# Altium schematic sheet Sensor Board.SchDoc
size A3; SheetNumber: 5
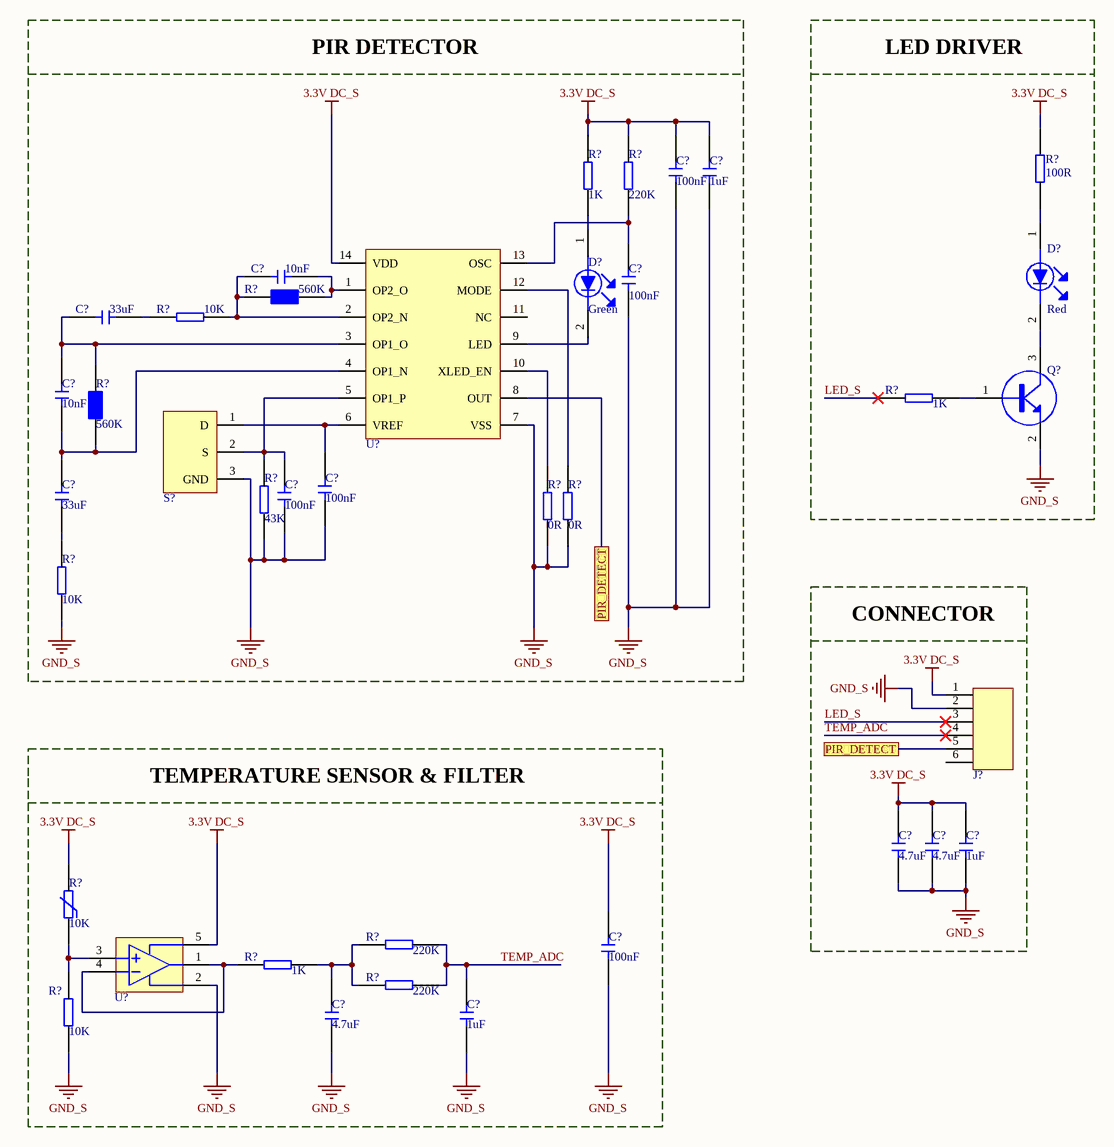
[diagram p0: Sensor Board.SchDoc]

## Parts
(Parts that share a designator on the sheet are numbered #1, #2 ... from top to bottom, then left to right.)
C?#1  Capacitance: 100nF  [CAP_0603]  (hidden comment: C0603C104K5RACTU)
C?#2  Capacitance: 1uF  [CAP_0805]  (hidden comment: CL21B105KBFNNNE)
C?#3  Capacitance: 10nF  [CAP_0603]  (hidden comment: 0603B103K160CT)
C?#4  Capacitance: 33uF  [CAP_1206]  (hidden comment: C3216X5R1E336M160AC)
C?#5  Capacitance: 100nF  [CAP_0603]  (hidden comment: C0603C104K5RACTU)
C?#6  Capacitance: 10nF  [CAP_0603]  (hidden comment: 0603B103K160CT)
C?#7  Capacitance: 100nF  [CAP_0603]  (hidden comment: C0603C104K5RACTU)
C?#8  Capacitance: 100nF  [CAP_0603]  (hidden comment: C0603C104K5RACTU)
C?#9  Capacitance: 33uF  [CAP_1206]  (hidden comment: C3216X5R1E336M160AC)
C?#10  Capacitance: 4.7uF  [CAP_0805]  (hidden comment: CL21A475KAQNNNE)
C?#11  Capacitance: 4.7uF  [CAP_0805]  (hidden comment: CL21A475KAQNNNE)
C?#12  Capacitance: 1uF  [CAP_0805]  (hidden comment: CL21B105KBFNNNE)
C?#13  Capacitance: 100nF  [CAP_0603]  (hidden comment: C0603C104K5RACTU)
C?#14  Capacitance: 4.7uF  [CAP_0805]  (hidden comment: CL21A475KAQNNNE)
C?#15  Capacitance: 1uF  [CAP_0805]  (hidden comment: CL21B105KBFNNNE)
D?#1  Color: Red  [LED RED_0805]  (hidden comment: LH R974-LP-1)
D?#2  Color: Green  [LED GREEN_0805]  (hidden comment: LTST-C171GKT)
J?  64800611622  [64800611622_6 PIN CON]  (value not drawn)
Q?  MMBT3904-7-F  [SOT-23F]  (value not drawn)
R?#1  Resistance: 100R  [RES_0603]  (hidden comment: RC0603JR-07100RL)
R?#2  Resistance: 1K  [RES_0603]  (hidden comment: RC0603FR-071KL)
R?#3  Resistance: 220K  [RES_0603]  (hidden comment: RC0603JR-07220KL)
R?#4  Resistance: 560K  [RES_0603]  (hidden comment: RC0603JR-07560KL)
R?#5  Resistance: 10K  [RES_0603]  (hidden comment: RC0603FR-0710KL)
R?#6  Resistance: 1K  [RES_0603]  (hidden comment: RC0603FR-071KL)
R?#7  Resistance: 560K  [RES_0603]  (hidden comment: RC0603JR-07560KL)
R?#8  Resistance: 43K  [RES_0603]  (hidden comment: RC0603JR-0743KL)
R?#9  Resistance: 0R  [RES_0603]  (hidden comment: RC0603JR-070RL)
R?#10  Resistance: 0R  [RES_0603]  (hidden comment: RC0603JR-070RL)
R?#11  Resistance: 10K  [RES_0603]  (hidden comment: RC0603FR-0710KL)
R?#12  Resistance: 10K  [RES_1206]  (hidden comment: TFPT1206L1002FM)
R?#13  Resistance: 220K  [RES_0603]  (hidden comment: RC0603JR-07220KL)
R?#14  Resistance: 1K  [RES_0603]  (hidden comment: RC0603FR-071KL)
R?#15  Resistance: 220K  [RES_0603]  (hidden comment: RC0603JR-07220KL)
R?#16  Resistance: 10K  [RES_0603]  (hidden comment: RC0603FR-0710KL)
S?  LHI 878/3902  [LHI 878]  (value not drawn)
U?#1  NCS36000DRG  [SOIC-14]  (value not drawn)
U?#2  OPA314AIDBVR  [SOT23-5]  (value not drawn)

## Blocks framed on the sheet
PIR DETECTOR: C?#1-C?#9 D?#2 R?#2-R?#5 R?#7-R?#11 S? U?#1

## Ports
PIR_DETECT

## Nets
3.3V DC_S: C?#1.2 C?#2.2 C?#10.2 C?#11.2 C?#12.2 C?#13.1 J?.1 R?#1.1 R?#2.2 R?#3.2 R?#12.2 U?#1.14(VDD) U?#2.5
GND_S: C?#1.1 C?#2.1 C?#5.1 C?#7.2 C?#8.1 C?#10.1 C?#11.1 C?#12.1 C?#13.2 C?#14.1 C?#15.1 J?.2 Q?.2(E) R?#8.1 R?#9.1 R?#10.1 R?#11.1 R?#16.1 S?.3(GND) U?#1.7(VSS) U?#2.2
LED_S: J?.3 R?#6.1
PIR_DETECT: J?.5 U?#1.8(OUT) ; port PIR_DETECT
TEMP_ADC: C?#15.2 J?.4 R?#13.2 R?#15.2
NetC?#3_1: C?#3.1 R?#4.1 R?#5.2 U?#1.2(OP2_N)
NetC?#3_2: C?#3.2 R?#4.2 U?#1.1(OP2_O)
NetC?#4_1: C?#4.1 C?#6.2 R?#7.2 U?#1.3(OP1_O)
NetC?#4_2: C?#4.2 R?#5.1
NetC?#5_2: C?#5.2 R?#3.1 U?#1.13(OSC)
NetC?#6_1: C?#6.1 C?#9.2 R?#7.1 U?#1.4(OP1_N)
NetC?#7_1: C?#7.1 R?#8.2 S?.2(S) U?#1.5(OP1_P)
NetC?#8_2: C?#8.2 S?.1(D) U?#1.6(VREF)
NetC?#9_1: C?#9.1 R?#11.2
NetC?#14_2: C?#14.2 R?#13.1 R?#14.2 R?#15.1
NetD?#1_1: D?#1.1(A) R?#1.2
NetD?#1_2: D?#1.2(K) Q?.3(C)
NetD?#2_1: D?#2.1(A) R?#2.1
NetD?#2_2: D?#2.2(K) U?#1.9(LED)
NetQ?_1: Q?.1(B) R?#6.2
NetR?#9_2: R?#9.2 U?#1.10(XLED_EN)
NetR?#10_2: R?#10.2 U?#1.12(MODE)
NetR?#12_1: R?#12.1 R?#16.2 U?#2.3
NetR?#14_1: R?#14.1 U?#2.1 U?#2.4

Not connected (* = marked no-connect by the designer): J? 6; U?#1 11(NC)

## Notes on the sheet
- LED DRIVER
- CONNECTOR
- TEMPERATURE SENSOR & FILTER
- Tanım/Description
- Hazırlayan/Prepared By
- Kontrol Eden/Checked By
- Değiştirme Tarihi/Change Date
- Yayın Tarihi/Release Date
- Mehmet Ali
- Onaylayan/Approved By
- Revizyon/Revision
- Hayta
- Bölüm/Department
- Dosya Adı/File Name
- Electronics&Hardware
- Boyut/Size
- Sayfa/Sheet
- A-3
- /

## Library data of the parts
C?#1 C?#5 C?#7 C?#8 C?#13 = CAP CER 100NF 0603: CAP CER 100NF %10 0603 SMD; Manufacturer: KEMET; Designed By: HAYTA; Dielectric Material: Ceramic; Voltage Rating (DC): 50V; Tolerance: 10%; Dielectric: X7R; Dissipation Factor: 2.5%; Supplier 1: Digi-Key; Manufacturer Part Number: C0603C104K5RACTU; RoHS: Yes; Category: Ceramic Capacitors; Mount: Surface Mount; Case/Package: CAP_0603; Number of Pins: 2; Case Code (Metric): 1608; Case Code (Imperial): 0603; Contact Plating: Tin,Matte; Min Operating Temperature: -55°C; Max Operating Temperature: 125°C; Packaging: Tape and Reel; Package Quantity: 1; Termination: SMD/SMT; Voltage: 50V; Voltage Rating: 50V; Series: SMD Comm X7R; Length: 0.063inch; Width: 0.031inch; Height: 0.8mm; Thickness: 0.034inch; Lead Pitch: 0.7mm; Depth: 0.8mm; Radiation Hardening: No; RoHS Compliant: Yes; REACH SVHC: No SVHC; ComponentLink1URL: https://datasheet.ciiva.com/7823/kem-c1002-x7r-smd-7823591.pdf?src-supplier=Element14; ComponentLink1Description: https://datasheet.ciiva.com/7823/kem-c1002-x7r-smd-7823591.pdf?src-supplier=Element14; ComponentLink2URL: https://datasheet.ciiva.com/7823/kem-c1002-x7r-smd-7823592.pdf?src-supplier=Element14; ComponentLink2Description: https://datasheet.ciiva.com/7823/kem-c1002-x7r-smd-7823592.pdf?src-supplier=Element14; ComponentLink3URL: https://datasheet.ciiva.com/5999/kem-c1002-x7r-smd-5999400.pdf?src-supplier=Farnell; ComponentLink3Description: https://datasheet.ciiva.com/5999/kem-c1002-x7r-smd-5999400.pdf?src-supplier=Farnell; ComponentLink4URL: https://datasheet.ciiva.com/28645/1851736-28645640.pdf?src-supplier=Element14; ComponentLink4Description: https://datasheet.ciiva.com/28645/1851736-28645640.pdf?src-supplier=Element14; ComponentLink5URL: https://datasheet.ciiva.com/14585/70095383-14585209.pdf?src-supplier=Allied+Electronics; ComponentLink5Description: https://datasheet.ciiva.com/14585/70095383-14585209.pdf?src-supplier=Allied+Electronics; ComponentLink6URL: https://datasheet.ciiva.com/14602/70095383-14602583.pdf?src-supplier=Allied+Electronics; ComponentLink6Description: https://datasheet.ciiva.com/14602/70095383-14602583.pdf?src-supplier=Allied+Electronics; Supplier Part Number 1: 399-5089-1-ND
C?#2 C?#12 C?#15 = CAP CER 1UF 0805: CAP CER 1UF %10 0805; Manufacturer: Samsung; Tolerance: 10%; Voltage Rating: 50V; Dielectric: X7R; Designed By: HAYTA; Supplier 1: Digi-Key; Manufacturer Part Number: CL21B105KBFNNNE; RoHS: Yes; Category: Ceramic Capacitors; Stock 1: 68093; Pricing 1: 1=0.12000, 10=0.08600, 50=0.04900, 100=0.04060, 500=0.02848, 1000=0.02358 (USD); Mount: Surface Mount; Case/Package: CAP_0805; Case Code (Metric): 2012; Case Code (Imperial): 0805; Min Operating Temperature: -55°C; Max Operating Temperature: 125°C; Packaging: Tape and Reel; Package Quantity: 1; Voltage: 50V; Series: CL; Construction: Flat; Length: 2mm; Width: 0.049inch; Height: 1.25mm; Thickness: 0.053inch; Depth: 1.25mm; Radiation Hardening: No; RoHS Compliant: Yes; ComponentLink1URL: https://datasheet.ciiva.com/25800/cl21b105kbfnnne-25800291.pdf?src-supplier=Digi-Key; ComponentLink1Description: https://datasheet.ciiva.com/25800/cl21b105kbfnnne-25800291.pdf?src-supplier=Digi-Key; ComponentLink2URL: https://datasheet.ciiva.com/16449/cl21b105kbfnnne-16449003.pdf?src-supplier=Future+Electronics; ComponentLink2Description: https://datasheet.ciiva.com/16449/cl21b105kbfnnne-16449003.pdf?src-supplier=Future+Electronics; ComponentLink3URL: https://datasheet.ciiva.com/26838/getdatasheetpartid-354075-26838668.pdf?src-supplier=Verical; ComponentLink3Description: https://datasheet.ciiva.com/26838/getdatasheetpartid-354075-26838668.pdf?src-supplier=Verical; Supplier Part Number 1: 1276-1029-1-ND
C?#3 C?#6 = CAP CER 10NF 0603: CAP CER 10NF %10 0603; Manufacturer: Walsin Technologies; Tolerance: 10%; Dielectric: X7R; Voltage Rating: 16V; Designed By: HAYTA; Supplier 1: Digi-Key; Manufacturer Part Number: 0603B103K160CT; RoHS: Yes; Category: Ceramic Capacitors; Stock 1: 156130; Pricing 1: 1=0.10000, 10=0.03600, 50=0.01980, 100=0.01620, 500=0.01156, 1000=0.00908 (USD); Case/Package: CAP_0603; Case Code (Metric): 1608; Case Code (Imperial): 0603; Min Operating Temperature: -55°C; Max Operating Temperature: 125°C; Packaging: Tape and Reel; Voltage Rating (DC): 16V; Length: 1.6mm; Depth: 0.8mm; REACH SVHC: Unknown; RoHS Compliant: Yes; ComponentLink1URL: http://www.farnell.com/datasheets/1958513.pdf?src-supplier=Farnell; ComponentLink1Description: http://www.farnell.com/datasheets/1958513.pdf?src-supplier=Farnell; ComponentLink2URL: http://components.arrow.com/part/dataview/0323_00656382?src-supplier=Arrow+Europe; ComponentLink2Description: http://components.arrow.com/part/dataview/0323_00656382?src-supplier=Arrow+Europe; ComponentLink3URL: http://www.farnell.com/datasheets/1958513.pdf?src-supplier=Element14; ComponentLink3Description: http://www.farnell.com/datasheets/1958513.pdf?src-supplier=Element14; ComponentLink4URL: http://www.passivecomponent.com/wp-content/uploads/2018/10/MLCC.pdf?src-supplier=Digi-Key; ComponentLink4Description: http://www.passivecomponent.com/wp-content/uploads/2018/10/MLCC.pdf?src-supplier=Digi-Key; Supplier Part Number 1: 1292-1384-1-ND
C?#4 C?#9 = CAP CER 33UF 1206: CAP CER 33UF %20 1206 SMD; Manufacturer: TDK; Dielectric Material: Ceramic; Voltage Rating: 25V; Tolerance: 20%; Dielectric: X5R; Designed By: HAYTA; Supplier 1: Digi-Key; Manufacturer Part Number: C3216X5R1E336M160AC; RoHS: Yes; Category: Ceramic Capacitors; Stock 1: 308; Pricing 1: 1=1.04000, 10=0.82500, 50=0.71500, 100=0.61880, 500=0.46750, 1000=0.41250 (USD); Mount: Surface Mount; Case/Package: CAP_1206; Case Code (Metric): 3216; Case Code (Imperial): 1206; Weight: 0.000571oz; Min Operating Temperature: -55°C; Max Operating Temperature: 85°C; Packaging: Tape and Reel; Termination: SMD/SMT; Series: C; Package Quantity: 1; Voltage Rating (DC): 25V; Resistor Type: Ceramic; Length: 3.2mm; Width: 0.063inch; Depth: 1.6mm; Thickness: 1.6mm; REACH SVHC: No SVHC; Lead Free: Lead Free; RoHS Compliant: Yes; ComponentLink1URL: https://datasheet.ciiva.com/24216/c3216x5r1e336m160ac-265051-24216512.pdf?src-supplier=Mouser; ComponentLink1Description: https://datasheet.ciiva.com/24216/c3216x5r1e336m160ac-265051-24216512.pdf?src-supplier=Mouser; ComponentLink2URL: https://datasheet.ciiva.com/6285/tdkmlcccaprange-6285278.pdf?src-supplier=Digi-Key; ComponentLink2Description: https://datasheet.ciiva.com/6285/tdkmlcccaprange-6285278.pdf?src-supplier=Digi-Key; Supplier Part Number 1: 445-8046-1-ND
C?#10 C?#11 C?#14 = CAP CER 4.7UF 0805: CAP CER 4.7UF %10 0805; Manufacturer: Samsung; Tolerance: 10%; Voltage Rating: 25V; Dielectric: X5R; Designed By: HAYTA; Supplier 1: Digi-Key; Manufacturer Part Number: CL21A475KAQNNNE; RoHS: Yes; Category: Ceramic Capacitors; Stock 1: 2239290; Pricing 1: 1=0.11000, 10=0.08000, 50=0.04520, 100=0.03740, 500=0.02624, 1000=0.02172 (USD); Mount: Surface Mount; Case/Package: CAP_0805; Case Code (Metric): 2012; Case Code (Imperial): 0805; Min Operating Temperature: -55°C; Max Operating Temperature: 85°C; Package Quantity: 1; Packaging: Tape and Reel; Voltage Rating (DC): 25V; Series: CL; Construction: Flat; Length: 2mm; Width: 0.049inch; Height: 1.25mm; Thickness: 0.055inch; Depth: 1.25mm; Radiation Hardening: No; Lead Free: Lead Free; RoHS Compliant: Yes; ComponentLink1URL: https://datasheet.ciiva.com/25798/cl21a475kaqnnne-25798882.pdf?src-supplier=Digi-Key; ComponentLink1Description: https://datasheet.ciiva.com/25798/cl21a475kaqnnne-25798882.pdf?src-supplier=Digi-Key; Supplier Part Number 1: 1276-1244-1-ND
D?#1 = LED_RED 0805: LED Uni-Color Hyper Red 660nm 2-Pin Chip 0805(2012Metric) T/R; Manufacturer: Osram Opto; Lens Color: White; Forward Voltage: 1.8V; Lens Style: Diffused,Flat,Colorless; Luminous Intensity: 71mcd; Viewing Angle: 160°; Forward Current: 30mA; Dominant Wavelength: 645nm; Number of Elements: 1; Test Current: 20mA; Reverse Voltage: 5V; Lens Transparency: Diffused; Luminous Flux: 0.17lm; Lens Size: 1.25mm; Designed By: HAYTA; Supplier 1: Digi-Key; Manufacturer Part Number: LH R974-LP-1; RoHS: Yes; Category: LEDs; Mount: Surface Mount; Case/Package: LED RED_0805; Number of Pins: 2; Case Code (Imperial): 0805; Case Code (Metric): 2012; Min Operating Temperature: -30°C; Max Operating Temperature: 85°C; Packaging: Tape and Reel; Illumination Color: Red; Package Quantity: 1; Series: CHipLED; Length: 2.1mm; Width: 1.25mm; Depth: 1.35mm; Radiation Hardening: No; RoHS Compliant: Yes; ComponentLink1URL: http://www.jameco.com/Jameco/Products/ProdDS/2085634.pdf?src-supplier=Jameco; ComponentLink1Description: http://www.jameco.com/Jameco/Products/ProdDS/2085634.pdf?src-supplier=Jameco; ComponentLink2URL: http://components.arrow.com/part/dataview/0323_01825492?src-supplier=Arrow+Europe; ComponentLink2Description: http://components.arrow.com/part/dataview/0323_01825492?src-supplier=Arrow+Europe; ComponentLink3URL: https://dammedia.osram.info/media/resource/hires/osram-dam-2493888/LH%20R974.pdf?src-supplier=Digi-Key; ComponentLink3Description: https://dammedia.osram.info/media/resource/hires/osram-dam-2493888/LH%20R974.pdf?src-supplier=Digi-Key; ComponentLink4URL: http://www.mouser.com/ds/2/311/LH%20R974%20-%20CHIPLED%200805-318659.pdf?src-supplier=Mouser; ComponentLink4Description: http://www.mouser.com/ds/2/311/LH%20R974%20-%20CHIPLED%200805-318659.pdf?src-supplier=Mouser; ComponentLink5URL: http://components.arrow.com/part/dataview/41971690S1077610N9133?src-supplier=Arrow+Electronics; ComponentLink5Description: http://components.arrow.com/part/dataview/41971690S1077610N9133?src-supplier=Arrow+Electronics; ComponentLink6URL: https://www.verical.com/server-webapp/html/getDatasheet?partID=258950&src-supplier=Verical; ComponentLink6Description: https://www.verical.com/server-webapp/html/getDatasheet?partID=258950&src-supplier=Verical; ComponentLink7URL: http://components.arrow.com/part/dataview/41971690S6190115N2128?src-supplier=Arrow+Electronics; ComponentLink7Description: http://components.arrow.com/part/dataview/41971690S6190115N2128?src-supplier=Arrow+Electronics; Supplier Part Number 1: 475-1415-1-ND
D?#2 = LED_GREEN 0805: Green 0805 130 º Min 5 mcd Typical 12 mcd Water Clear Lens SMT LED; Manufacturer: Vishay Lite-On; Lens Color: Colorless; Viewing Angle: 130°; Lens Style: Diffused,Colorless,Rectangular,Clear; Luminous Intensity: 12mcd; Forward Current: 30mA; Forward Voltage: 2.1V; Power Rating: 100mW; Dominant Wavelength: 569nm; Test Current: 10mA; Number of Elements: 1; Wavelength: 585nm; Reverse Voltage: 5V; Designed By: HAYTA; Supplier 1: Digi-Key; Manufacturer Part Number: LTST-C171GKT; RoHS: Yes; Category: LEDs; Stock 1: 481058; Pricing 1: 1=0.26000, 10=0.14100, 100=0.06560, 500=0.06060, 1000=0.04747 (USD); Mount: Surface Mount; Case/Package: LED GREEN_0805; Number of Pins: 2; Case Code (Metric): 2012; Case Code (Imperial): 0805; Min Operating Temperature: -55°C; Max Operating Temperature: 85°C; Package Quantity: 1; Packaging: Tape and Reel; Illumination Color: Green; Lens Transparency: Clear; Power Dissipation: 100mW; Number of LEDs: 1; Series: CHIPLED 0805; Length: 2mm; Width: 1.25mm; Height: 0.8mm; Depth: 1.25mm; Radiation Hardening: No; Lead Free: Lead Free; RoHS Compliant: Yes; ComponentLink1URL: https://datasheet.ciiva.com/2110/ltst-c171gkt-2110000.pdf?src-supplier=Digi-Key; ComponentLink1Description: https://datasheet.ciiva.com/2110/ltst-c171gkt-2110000.pdf?src-supplier=Digi-Key; ComponentLink2URL: https://datasheet.ciiva.com/11773/0900766b80dc0296-11773991.pdf?src-supplier=RSComponents; ComponentLink2Description: https://datasheet.ciiva.com/11773/0900766b80dc0296-11773991.pdf?src-supplier=RSComponents; ComponentLink3URL: https://datasheet.ciiva.com/12400/lite-on-ltst-c171gkt-190133-12400647.pdf?src-supplier=Mouser; ComponentLink3Description: https://datasheet.ciiva.com/12400/lite-on-ltst-c171gkt-190133-12400647.pdf?src-supplier=Mouser; ComponentLink4URL: https://datasheet.ciiva.com/2110/ltst-c171gkt-2110001.pdf?src-supplier=Digi-Key; ComponentLink4Description: https://datasheet.ciiva.com/2110/ltst-c171gkt-2110001.pdf?src-supplier=Digi-Key; ComponentLink5URL: https://datasheet.ciiva.com/2110/ltst-c171gkt-2110002.pdf?src-supplier=Digi-Key; ComponentLink5Description: https://datasheet.ciiva.com/2110/ltst-c171gkt-2110002.pdf?src-supplier=Digi-Key; ComponentLink6URL: https://datasheet.ciiva.com/16396/ltst-c171gkt-16396549.pdf?src-supplier=Future+Electronics; ComponentLink6Description: https://datasheet.ciiva.com/16396/ltst-c171gkt-16396549.pdf?src-supplier=Future+Electronics; Supplier Part Number 1: 160-1423-1-ND
J? = 64800611622_6 PIN CON: 1.5mm 6 PIN CONNECTOR; Manufacturer: Wurth Electronics; Designed By: HAYTA; Supplier 1: RSComponents; Manufacturer Part Number: 64800611622; RoHS: No; Stock 1: 130; Pricing 1: 1000=0.29900, 2000=0.28200 (GBP); Supplier Part Number 1: 2138726; Case/Package: 64800611622_6 PIN CON
Q? = MMBT3904-7-F: Transistor General Purpose BJT NPN 40 Volt 0.2A Automotive 3-Pin SOT-23; Manufacturer: Diodes Zetex; Max Power Dissipation: 300mW; Collector Emitter Voltage (VCEO): 40V; Max Collector Current: 200mA; Collector Base Voltage (VCBO): 60V; Frequency: 300MHz; hFE Min: 100; Number of Elements: 1; Emitter Base Voltage (VEBO): 6V; Collector Emitter Saturation Voltage: 300mV; Power Dissipation: 350mW; Element Configuration: Single; Designed By: HAYTA; Supplier 1: Digi-Key; Manufacturer Part Number: MMBT3904-7-F; RoHS: Yes; Category: BJTs; Pricing 1: 1=0.13000, 10=0.11700, 100=0.06370, 500=0.03918, 1000=0.02671 (USD); Mount: Surface Mount; Case/Package: SOT-23F; Number of Pins: 3; Weight: 0.000282oz; Contact Plating: Tin,Matte; Min Operating Temperature: -55°C; Max Operating Temperature: 150°C; Polarity: NPN; Packaging: Tape and Reel; Package Quantity: 3000; Transition Frequency: 300MHz; Collector Emitter Breakdown Voltage: 40V; Max Breakdown Voltage: 40V; Continuous Collector Current: 200mA; Max Frequency: 300MHz; Gain Bandwidth Product: 300MHz; Series: -; Collector-emitter Voltage-Max: 300mV; Voltage Rating (DC): 40V; Length: 3.05mm; Width: 1.4mm; Height: 1mm; Radiation Hardening: No; REACH SVHC: No SVHC; Lead Free: Lead Free; RoHS Compliant: Yes; ComponentLink1URL: https://datasheet.ciiva.com/11201/ds30036-11201778.pdf?src-supplier=Avnet; ComponentLink1Description: https://datasheet.ciiva.com/11201/ds30036-11201778.pdf?src-supplier=Avnet; ComponentLink2URL: https://datasheet.ciiva.com/15138/getdatasheetpartid-53265-15138780.pdf?src-supplier=Verical; ComponentLink2Description: https://datasheet.ciiva.com/15138/getdatasheetpartid-53265-15138780.pdf?src-supplier=Verical; ComponentLink3URL: https://datasheet.ciiva.com/22711/1915516-22711750.pdf?src-supplier=Element14; ComponentLink3Description: https://datasheet.ciiva.com/22711/1915516-22711750.pdf?src-supplier=Element14; ComponentLink4URL: https://datasheet.ciiva.com/11198/ds30036-11198999.pdf?src-supplier=Avnet; ComponentLink4Description: https://datasheet.ciiva.com/11198/ds30036-11198999.pdf?src-supplier=Avnet; ComponentLink5URL: https://datasheet.ciiva.com/6361/ds30036-6361256.pdf?src-supplier=Digi-Key; ComponentLink5Description: https://datasheet.ciiva.com/6361/ds30036-6361256.pdf?src-supplier=Digi-Key; ComponentLink6URL: https://datasheet.ciiva.com/6361/ds30036-6361254.pdf?src-supplier=Digi-Key; ComponentLink6Description: https://datasheet.ciiva.com/6361/ds30036-6361254.pdf?src-supplier=Digi-Key; Supplier Part Number 1: MMBT3904-FDICT-ND
R?#1 = RES 100R 0603: RES 100R %5 0603 SMD; Manufacturer: Yageo; Tolerance: 5%; Temperature Coefficient: 100ppm/°C; Voltage Rating (DC): 50V; Power Rating: 100mW; Designed By: HAYTA; Supplier 1: Digi-Key; Manufacturer Part Number: RC0603JR-07100RL; RoHS: Yes; Category: Chip SMD Resistors; Stock 1: 1746627; Pricing 1: 1=0.10000, 10=0.02000, 100=0.00800, 1000=0.00360, 2500=0.00312 (USD); Case/Package: RES_0603; Number of Pins: 2; Contact Plating: Tin,Matte; Case Code (Imperial): 0603; Case Code (Metric): 1608; Size Code: 0603; Min Operating Temperature: -55°C; Max Operating Temperature: 155°C; Resistor Type: Thick Film; Packaging: Tape and Reel; Voltage Rating: 50V; Termination: SMD/SMT; Features: Moisture Resistant; Series: RC; Max Power Dissipation: 100mW; Number of Terminations: 2; Construction: Rectangular; Resistance Tolerance: 5%; Length: 1.6mm; Width: 0.8mm; Depth: 0.8mm; Radiation Hardening: No; REACH SVHC: Unknown; Lead Free: Lead Free; Military Standard: Not; RoHS Compliant: Yes; ComponentLink1URL: https://datasheet.ciiva.com/7746/443971-7746425.pdf?src-supplier=Element14; ComponentLink1Description: https://datasheet.ciiva.com/7746/443971-7746425.pdf?src-supplier=Element14; ComponentLink2URL: https://datasheet.ciiva.com/7746/443971-7746426.pdf?src-supplier=Element14; ComponentLink2Description: https://datasheet.ciiva.com/7746/443971-7746426.pdf?src-supplier=Element14; ComponentLink3URL: https://datasheet.ciiva.com/8883/pyu-rc0603-51-rohs-l-4-8883047.pdf?src-supplier=Avnet; ComponentLink3Description: https://datasheet.ciiva.com/8883/pyu-rc0603-51-rohs-l-4-8883047.pdf?src-supplier=Avnet; ComponentLink4URL: https://datasheet.ciiva.com/15189/getdatasheetpartid-325207-15189846.pdf?src-supplier=Verical; ComponentLink4Description: https://datasheet.ciiva.com/15189/getdatasheetpartid-325207-15189846.pdf?src-supplier=Verical; Supplier Part Number 1: 311-100GRCT-ND
R?#2 R?#6 R?#14 = RES 1K 0603: RES 1K %1 0603 SMD; Manufacturer: Yageo; Tolerance: 1%; Temperature Coefficient: 100ppm/°C; Power Rating: 100mW; Voltage Rating: 50V; Designed By: HAYTA; Supplier 1: Digi-Key; Manufacturer Part Number: RC0603FR-071KL; RoHS: Yes; Category: Chip SMD Resistors; Stock 1: 9652710; Pricing 1: 1=0.10000, 10=0.02400, 100=0.00970, 1000=0.00436, 2500=0.00378 (USD); Case/Package: RES_0603; Contact Plating: Tin,Matte; Case Code (Imperial): 0603; Case Code (Metric): 1608; Size Code: 0603; Min Operating Temperature: -55°C; Max Operating Temperature: 155°C; Resistor Type: Thick Film; Packaging: Tape and Reel; Termination: SMD/SMT; Features: Moisture Resistant; Series: RC; Max Power Dissipation: 100mW; Number of Terminations: 2; Technology: THICK FILM; Resistance Tolerance: 1%; Construction: Rectangular; Length: 1.6mm; Height: 0.45mm; Depth: 0.8mm; Radiation Hardening: No; REACH SVHC: No SVHC; Lead Free: Lead Free; Military Standard: Not; RoHS Compliant: Yes; Supplier Part Number 1: 311-1.00KHRCT-ND
R?#3 R?#13 R?#15 = RES 220K 0603: RES 220K %5 0603 SMD; Manufacturer: Yageo; Tolerance: 5%; Temperature Coefficient: 100ppm/°C; Voltage Rating (DC): 50V; Power Rating: 100mW; Designed By: HAYTA; Supplier 1: Digi-Key; Manufacturer Part Number: RC0603JR-07220KL; RoHS: Yes; Category: Chip SMD Resistors; Stock 1: 522153; Pricing 1: 1=0.10000, 10=0.02000, 100=0.00800, 1000=0.00360, 2500=0.00312 (USD); Case/Package: RES_0603; Number of Pins: 2; Case Code (Imperial): 0603; Case Code (Metric): 1608; Size Code: 0603; Min Operating Temperature: -55°C; Max Operating Temperature: 155°C; Resistor Type: Thick Film; Packaging: Tape and Reel; Voltage Rating: 50V; Package Quantity: 1; Termination: SMD/SMT; Number of Terminations: 2; Max Power Dissipation: 100mW; Features: Moisture Resistant; Series: RC; Construction: Rectangular; Resistance Tolerance: 5%; Length: 1.6mm; Width: 0.031inch; Height: 0.022inch; Depth: 0.8mm; REACH SVHC: No SVHC; Lead Free: Lead Free; RoHS Compliant: Yes; Military Standard: Not; ComponentLink1URL: https://datasheet.ciiva.com/2452/pyu-r-int-thick-7-2452924.pdf?src-supplier=Digi-Key; ComponentLink1Description: https://datasheet.ciiva.com/2452/pyu-r-int-thick-7-2452924.pdf?src-supplier=Digi-Key; ComponentLink2URL: https://datasheet.ciiva.com/2452/pyu-r-int-thick-7-2452925.pdf?src-supplier=Digi-Key; ComponentLink2Description: https://datasheet.ciiva.com/2452/pyu-r-int-thick-7-2452925.pdf?src-supplier=Digi-Key; ComponentLink3URL: https://datasheet.ciiva.com/2452/pyu-r-int-thick-7-2452923.pdf?src-supplier=Digi-Key; ComponentLink3Description: https://datasheet.ciiva.com/2452/pyu-r-int-thick-7-2452923.pdf?src-supplier=Digi-Key; Supplier Part Number 1: 311-220KGRCT-ND
R?#4 R?#7 = RES 560K 0603: RES 560K %5 1/10W 0603 SMD; Manufacturer: Yageo; Power Rating: 100mW; Tolerance: 5%; Voltage Rating: 75V; Voltage Rating (DC): 50V; Temperature Coefficient: 100ppm/°C; Designed By: HAYTA; Supplier 1: Digi-Key; Manufacturer Part Number: RC0603JR-07560KL; RoHS: Yes; Category: Chip SMD Resistors; Stock 1: 588501; Pricing 1: 1=0.10000, 10=0.02000, 100=0.00800, 1000=0.00360, 2500=0.00312 (USD); Case/Package: RES_0603; Number of Pins: 2; Case Code (Metric): 1608; Case Code (Imperial): 0603; Weight: 7.1E-05oz; Min Operating Temperature: -55°C; Max Operating Temperature: 155°C; Package Quantity: 1; Packaging: Tape and Reel; Resistor Type: Thick Film; Number of Terminations: 2; Termination: SMD/SMT; Max Power Dissipation: 100mW; Working Voltage: 75V; Features: Moisture Resistant; Series: RC; Resistance Tolerance: 5%; Construction: Rectangular; Technology: THICK FILM; Length: 1.6mm; Width: 0.8mm; Height: 0.022inch; Depth: 0.8mm; REACH SVHC: Unknown; Military Standard: Not; Lead Free: Lead Free; RoHS Compliant: Yes; ComponentLink1URL: https://datasheet.ciiva.com/2453/pyu-r-int-thick-7-2453056.pdf?src-supplier=Digi-Key; ComponentLink1Description: https://datasheet.ciiva.com/2453/pyu-r-int-thick-7-2453056.pdf?src-supplier=Digi-Key; ComponentLink2URL: https://datasheet.ciiva.com/2453/pyu-r-int-thick-7-2453057.pdf?src-supplier=Digi-Key; ComponentLink2Description: https://datasheet.ciiva.com/2453/pyu-r-int-thick-7-2453057.pdf?src-supplier=Digi-Key; ComponentLink3URL: https://datasheet.ciiva.com/2453/pyu-r-int-thick-7-2453055.pdf?src-supplier=Digi-Key; ComponentLink3Description: https://datasheet.ciiva.com/2453/pyu-r-int-thick-7-2453055.pdf?src-supplier=Digi-Key; Supplier Part Number 1: 311-560KGRCT-ND
R?#5 R?#11 R?#16 = RES 10K 0603: RES 10K %1 0603 SMD; Manufacturer: Yageo; Tolerance: 1%; Temperature Coefficient: 100ppm/°C; Voltage Rating (DC): 50V; Power Rating: 100mW; Voltage Rating: 75V; Designed By: HAYTA; Supplier 1: Digi-Key; Manufacturer Part Number: RC0603FR-0710KL; RoHS: Yes; Category: Chip SMD Resistors; Stock 1: 23496788; Pricing 1: 1=0.10000, 10=0.02400, 100=0.00970, 1000=0.00436, 2500=0.00378 (USD); Case/Package: RES_0603; Number of Pins: 2; Case Code (Imperial): 0603; Case Code (Metric): 1608; Weight: 7.1E-05oz; Size Code: 0603; Min Operating Temperature: -55°C; Max Operating Temperature: 155°C; Resistor Type: Thick Film; Packaging: Tape and Reel; Termination: SMD/SMT; Features: Moisture Resistant; Series: RC; Max Power Dissipation: 100mW; Number of Terminations: 2; Resistance Tolerance: 1%; Construction: Rectangular; Length: 1.6mm; Width: 0.8mm; Height: 0.45mm; Depth: 0.8mm; Lead Pitch: 0.3mm; REACH SVHC: Unknown; Lead Free: Lead Free; Military Standard: Not; RoHS Compliant: Yes; ComponentLink1URL: https://datasheet.ciiva.com/7660/38590-7660789.pdf?src-supplier=Element14; ComponentLink1Description: https://datasheet.ciiva.com/7660/38590-7660789.pdf?src-supplier=Element14; ComponentLink2URL: https://datasheet.ciiva.com/7983/443971-7983596.pdf?src-supplier=Element14; ComponentLink2Description: https://datasheet.ciiva.com/7983/443971-7983596.pdf?src-supplier=Element14; ComponentLink3URL: https://datasheet.ciiva.com/22747/443971-22747519.pdf?src-supplier=Element14; ComponentLink3Description: https://datasheet.ciiva.com/22747/443971-22747519.pdf?src-supplier=Element14; ComponentLink4URL: https://datasheet.ciiva.com/46440/1868787-46440891.pdf?src-supplier=Element14; ComponentLink4Description: https://datasheet.ciiva.com/46440/1868787-46440891.pdf?src-supplier=Element14; ComponentLink5URL: https://datasheet.ciiva.com/7746/1738695-7746239.pdf?src-supplier=Element14; ComponentLink5Description: https://datasheet.ciiva.com/7746/1738695-7746239.pdf?src-supplier=Element14; ComponentLink6URL: https://datasheet.ciiva.com/15189/getdatasheetpartid-409289-15189591.pdf?src-supplier=Verical; ComponentLink6Description: https://datasheet.ciiva.com/15189/getdatasheetpartid-409289-15189591.pdf?src-supplier=Verical; Supplier Part Number 1: 311-10.0KHRCT-ND
R?#8 = RES 43K 0603: RES 43K %5 0603 SMD; Manufacturer: Yageo; Voltage Rating: 75V; Power Rating: 100mW; Tolerance: 5%; Temperature Coefficient: 100ppm/°C; Voltage Rating (DC): 50V; Designed By: HAYTA; Supplier 1: Digi-Key; Manufacturer Part Number: RC0603JR-0743KL; RoHS: Yes; Category: Chip SMD Resistors; Stock 1: 2730; Pricing 1: 1=0.10000, 10=0.02000, 100=0.00800, 1000=0.00360, 2500=0.00312 (USD); Case/Package: RES_0603; Case Code (Imperial): 0603; Case Code (Metric): 1608; Weight: 7.1E-05oz; Min Operating Temperature: -55°C; Max Operating Temperature: 155°C; Packaging: Tape and Reel; Package Quantity: 1; Termination: SMD/SMT; Resistor Type: Thick Film; Number of Terminations: 2; Max Power Dissipation: 100mW; Working Voltage: 75V; Features: Moisture Resistant; Series: RC; Construction: Rectangular; Technology: THICK FILM; Length: 1.6mm; Width: 0.8mm; Height: 0.022inch; Depth: 0.8mm; Military Standard: Not; Lead Free: Lead Free; RoHS Compliant: Yes; ComponentLink1URL: https://datasheet.ciiva.com/2453/pyu-r-int-thick-7-2453053.pdf?src-supplier=Digi-Key; ComponentLink1Description: https://datasheet.ciiva.com/2453/pyu-r-int-thick-7-2453053.pdf?src-supplier=Digi-Key; ComponentLink2URL: https://datasheet.ciiva.com/2453/pyu-r-int-thick-7-2453054.pdf?src-supplier=Digi-Key; ComponentLink2Description: https://datasheet.ciiva.com/2453/pyu-r-int-thick-7-2453054.pdf?src-supplier=Digi-Key; ComponentLink3URL: https://datasheet.ciiva.com/2453/pyu-r-int-thick-7-2453052.pdf?src-supplier=Digi-Key; ComponentLink3Description: https://datasheet.ciiva.com/2453/pyu-r-int-thick-7-2453052.pdf?src-supplier=Digi-Key; Supplier Part Number 1: 311-43KGRCT-ND
R?#9 R?#10 = RES 0R 0603: RES 0R %1 0603 SMD; Manufacturer: Yageo; Tolerance: 1%; Power Rating: 100mW; Voltage Rating (DC): 50V; Temperature Coefficient: 200ppm/°C; Resistance Tolerance: 5%; Designed By: HAYTA; Supplier 1: Digi-Key; Manufacturer Part Number: RC0603JR-070RL; RoHS: Yes; Category: Chip SMD Resistors; Pricing 1: 1=0.10000, 10=0.01700, 25=0.01240, 50=0.00940, 100=0.00700, 250=0.00532, 500=0.00424, 1000=0.00313 (USD); Case/Package: RES_0603; Number of Pins: 2; Contact Plating: Tin,Matte; Case Code (Imperial): 0603; Case Code (Metric): 1608; Size Code: 0603; Min Operating Temperature: -55°C; Max Operating Temperature: 155°C; Resistor Type: Thick Film; Packaging: Tape and Reel; Termination: SMD/SMT; Series: RC; Technology: THICK FILM; Package Quantity: 5000; Voltage Rating: 50V; Features: Moisture Resistant; Max Power Dissipation: 100mW; Number of Terminations: 2; Construction: Rectangular; Length: 1.6mm; Width: 0.8mm; Height: 0.45mm; Depth: 0.8mm; Radiation Hardening: No; REACH SVHC: No SVHC; Lead Free: Lead Free; RoHS Compliant: Yes; Military Standard: Not; Supplier Part Number 1: 311-0.0GRCT-ND
R?#12 = RES PTC 10K 1206: RES_PTC 10K %1 1206; Manufacturer: Vishay Dale; Tolerance: 1%; Power Rating: 125mW; Voltage: 40V; Designed By: HAYTA; Supplier 1: Digi-Key; Manufacturer Part Number: TFPT1206L1002FM; RoHS: Yes; Category: Thermistors; Stock 1: 21726; Pricing 1: 1=1.39000, 5=1.34200, 10=1.09000, 25=0.93920, 50=0.81360, 100=0.73810, 500=0.62068, 1000=0.55358 (USD); Mount: Surface Mount; Case/Package: RES_1206; Number of Pins: 2; Min Operating Temperature: -55°C; Max Operating Temperature: 125°C; Packaging: Tape and Reel; Package Quantity: 5000; Max Power Dissipation: 125mW; Termination: SMD/SMT; Series: TFPT; Resistance Tolerance: 1%; Length: 3.2mm; Width: 1.6mm; Height: 0.55mm; Depth: 1.6mm; Lead Free: Lead Free; RoHS Compliant: Yes; ComponentLink1URL: https://datasheet.ciiva.com/2852/tfpt-2852076.pdf?src-supplier=Digi-Key; ComponentLink1Description: https://datasheet.ciiva.com/2852/tfpt-2852076.pdf?src-supplier=Digi-Key; Supplier Part Number 1: 541-3533-1-ND
S? = LHI 878/3902: SENSOR PYRO DETECTOR DUAL MOTION; Manufacturer: Excelitas; Max Supply Voltage: 12; Min Supply Voltage: 2; Designed By: HAYTA; Type: Pyro Detector; Supplier 1: Digi-Key; Manufacturer Part Number: LHI878/3902; RoHS: No; Supplier Part Number 1: 1601-LHI878/3902-ND; Case/Package: LHI 878
U?#1 = NCS36000DRG: PIR Controller Low Noise Amplifiers and LDO Regulator 14-Pin SOIC N T/R; Manufacturer: ON Semiconductor; Operating Supply Current: 50uA; Quiescent Current: 20uA; Min Supply Voltage: 3V; Max Supply Voltage: 5.75V; Output Type: Digital; Designed By: HAYTA; Supplier 1: Digi-Key; Manufacturer Part Number: NCS36000DRG; RoHS: Yes; Category: Amplifiers - Op Amps, Buffer, Instrumentation; Pricing 1: 1=0.99000, 10=0.86900, 25=0.81640, 100=0.66620, 250=0.61876, 500=0.52660, 1000=0.43470 (USD); Case/Package: SOIC-14; Number of Pins: 14; Min Operating Temperature: -40°C; Max Operating Temperature: 85°C; Package Quantity: 1; Packaging: Tape and Reel; Series: -; Input Type: DIGITAL; Length: 8.75mm; Width: 4mm; Height: 1.5mm; Radiation Hardening: No; REACH SVHC: No SVHC; Lead Free: Lead Free; Halogen Free: Halogen Free; RoHS Compliant: Yes; ComponentLink1URL: https://datasheet.ciiva.com/1781/ncs36000-d-1781637.pdf?src-supplier=Digi-Key; ComponentLink1Description: https://datasheet.ciiva.com/1781/ncs36000-d-1781637.pdf?src-supplier=Digi-Key; ComponentLink2URL: https://datasheet.ciiva.com/4763/ncs36000-d-89569-4763639.pdf?src-supplier=Mouser; ComponentLink2Description: https://datasheet.ciiva.com/4763/ncs36000-d-89569-4763639.pdf?src-supplier=Mouser; ComponentLink3URL: https://datasheet.ciiva.com/1781/ncs36000-d-1781638.pdf?src-supplier=Digi-Key; ComponentLink3Description: https://datasheet.ciiva.com/1781/ncs36000-d-1781638.pdf?src-supplier=Digi-Key; ComponentLink4URL: https://datasheet.ciiva.com/1781/ncs36000-d-1781639.pdf?src-supplier=Digi-Key; ComponentLink4Description: https://datasheet.ciiva.com/1781/ncs36000-d-1781639.pdf?src-supplier=Digi-Key; ComponentLink5URL: https://datasheet.ciiva.com/26166/ncs36000-d-26166711.pdf?src-supplier=Avnet+Europe; ComponentLink5Description: https://datasheet.ciiva.com/26166/ncs36000-d-26166711.pdf?src-supplier=Avnet+Europe; ComponentLink6URL: https://datasheet.ciiva.com/2965/ncs36000-d-2965212.pdf?src-supplier=Avnet; ComponentLink6Description: https://datasheet.ciiva.com/2965/ncs36000-d-2965212.pdf?src-supplier=Avnet; ComponentLink7URL: https://datasheet.ciiva.com/2966/ncs36000-d-2966525.pdf?src-supplier=Avnet; ComponentLink7Description: https://datasheet.ciiva.com/2966/ncs36000-d-2966525.pdf?src-supplier=Avnet; Supplier Part Number 1: NCS36000DRGOSCT-ND
U?#2 = OPA314: Op Amp OPA314; Manufacturer: Texas Instruments; Min Supply Voltage: 1.8V; Max Supply Voltage: 5.5V; Min Dual Supply Voltage: 900mV; Max Dual Supply Voltage: 2.75V; Voltage Gain: 128dB; Common Mode Rejection Ratio: 75dB; Gain Bandwidth Product: 3MHz; Output Current: 20mA; Nominal Supply Current: 150uA; Number of Channels: 1; Slew Rate: 1.5V/µs; Max I/O Voltage: 2.5mV; Input Bias Current: 10pA; Power Supply Rejection Ratio (PSRR): 78dB; Amplifier Type: GENERAL PURPOSE; Designed By: HAYTA; Supplier 1: Digi-Key; Manufacturer Part Number: OPA314AIDBVR; RoHS: Yes; Category: Amplifiers - Op Amps, Buffer, Instrumentation; Pricing 1: 1=1.21000, 10=1.08500, 25=1.03000, 100=0.84600, 250=0.79080, 500=0.69886, 1000=0.60725 (USD); Case/Package: SOT23-5; Number of Pins: 5; Contact Plating: Gold; Min Operating Temperature: -40°C; Max Operating Temperature: 125°C; Package Quantity: 1; Packaging: Tape and Reel; Unity Gain Bandwidth Product: 3MHz; Nominal Gain Bandwidth Product: 3MHz; Input Offset Voltage (Vos): 2.5mV; Operating Supply Current: 150uA; Number of Circuits: 1; Output Current per Channel: 20mA; Number of Elements: 1; Supply Current: 150uA; Series: -; Technology: CMOS; Radiation Hardening: No; Lead Free: Lead Free; RoHS Compliant: Yes; ComponentLink1URL: https://datasheet.ciiva.com/29638/opa314-29638827.pdf?src-supplier=Digi-Key; ComponentLink1Description: https://datasheet.ciiva.com/29638/opa314-29638827.pdf?src-supplier=Digi-Key; ComponentLink2URL: https://datasheet.ciiva.com/14462/opa2314-14462006.pdf?src-supplier=Avnet; ComponentLink2Description: https://datasheet.ciiva.com/14462/opa2314-14462006.pdf?src-supplier=Avnet; ComponentLink3URL: https://datasheet.ciiva.com/26226/opa2314-26226295.pdf?src-supplier=Avnet+Europe; ComponentLink3Description: https://datasheet.ciiva.com/26226/opa2314-26226295.pdf?src-supplier=Avnet+Europe; ComponentLink4URL: https://datasheet.ciiva.com/14456/opa2314-14456281.pdf?src-supplier=Avnet; ComponentLink4Description: https://datasheet.ciiva.com/14456/opa2314-14456281.pdf?src-supplier=Avnet; Supplier Part Number 1: 296-36699-1-ND